# EAGLE design WdParent (EAGLE 8.5.1)
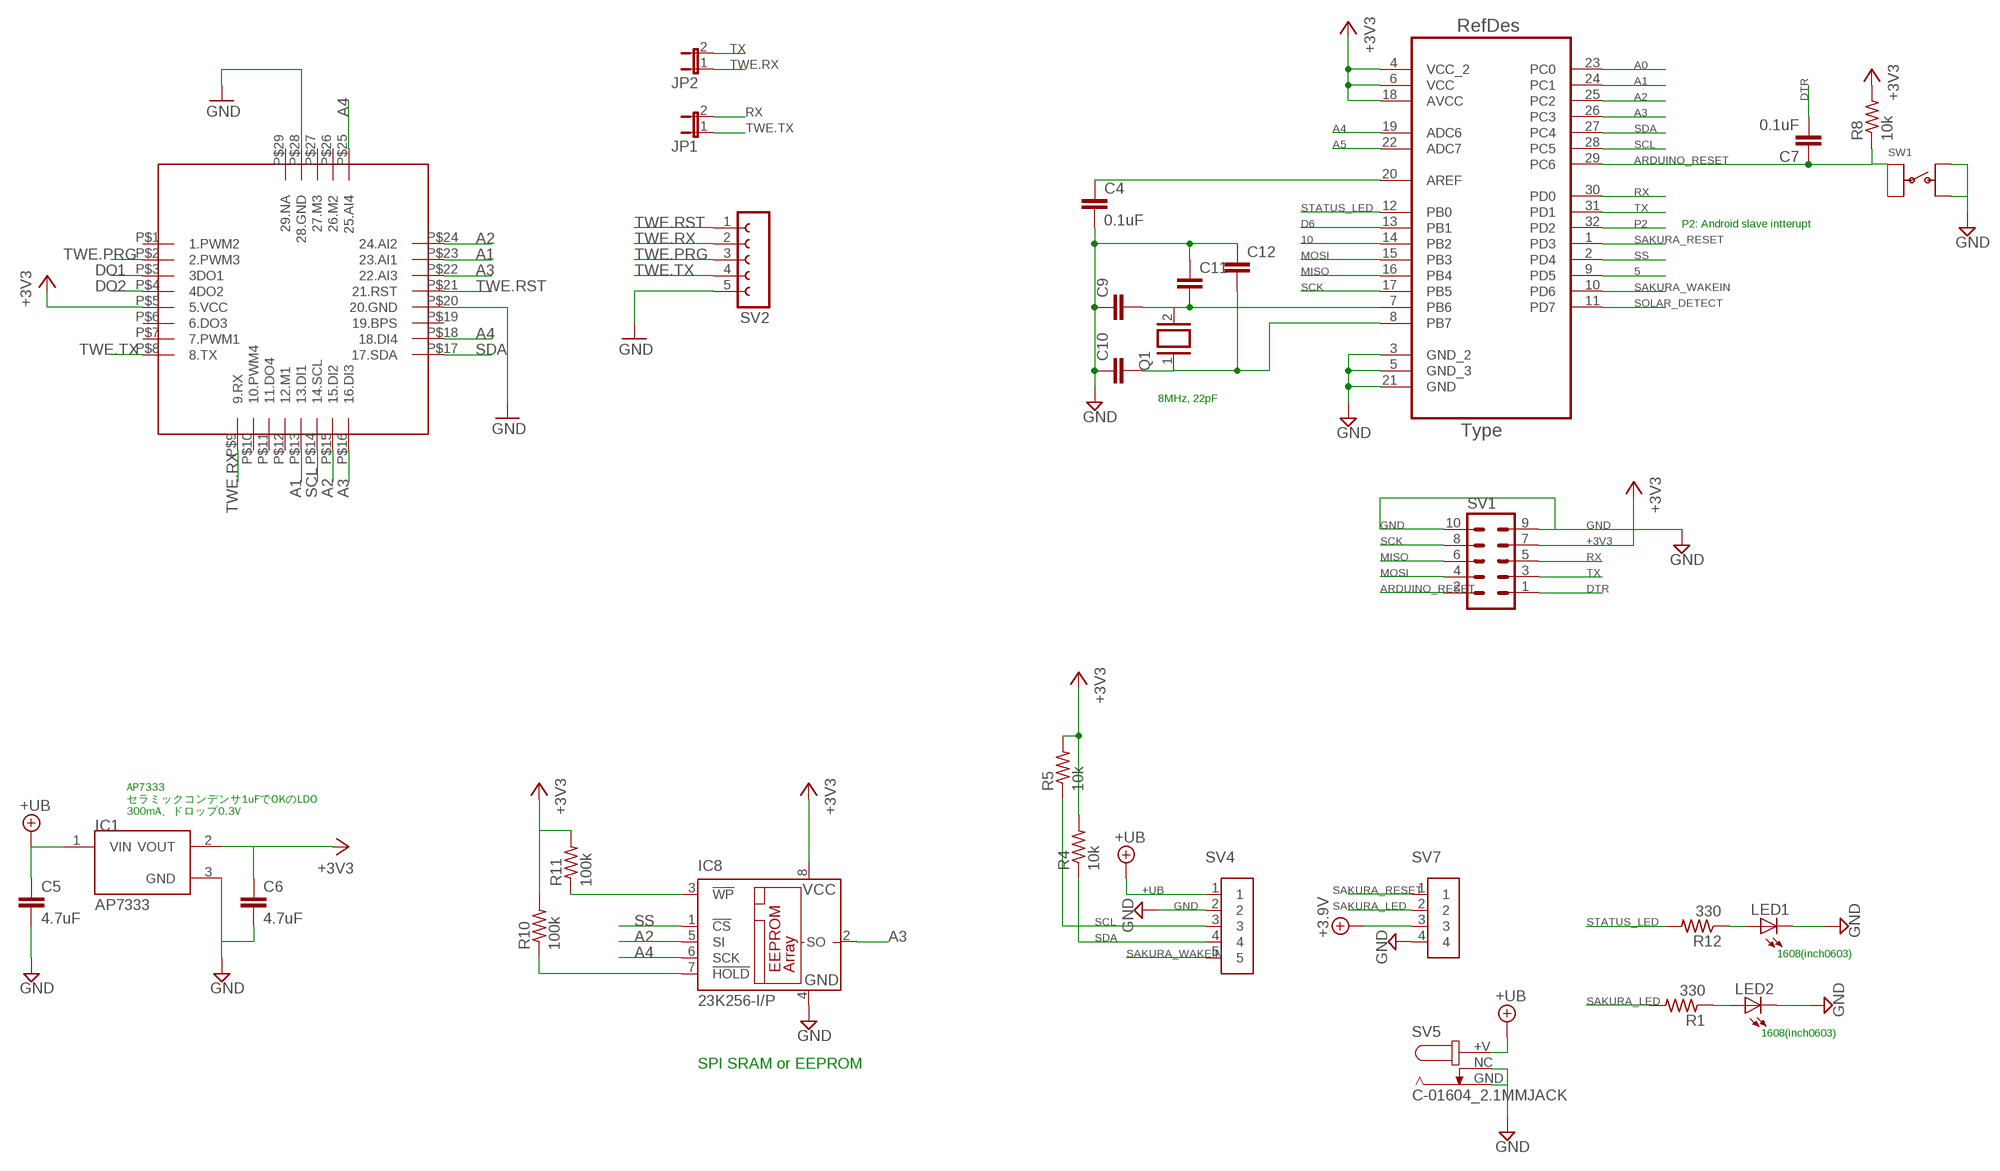
[diagram p0: schematic, sheet 1]

## Parts
C4  0.1uF  C-EUC0603  [C0603]
C5  4.7uF  C-EUC0603  [C0603]
C6  4.7uF  C-EUC0603  [C0603]
C7  0.1uF  C-EUC0603  [C0603]
C9  C-EU025-025X050  [C025-025X050]
C10  C-EU025-025X050  [C025-025X050]
C11  C-EUC0603  [C0603]
C12  C-EUC0603  [C0603]
IC1  AP7333  I-11360_AP7333_LDO3V3_REG  [SOT23]
IC8  23K256-I/P  25AA040P  [DIL8]
JP1  JP1E  [JP1]
JP2  JP1E  [JP1]
LED1  LEDCHIPLED_0603  [CHIPLED_0603]
LED2  LEDCHIPLED_0603  [CHIPLED_0603]
Q1  XTAL/S  [QS]
R1  330  R-US_R0603  [R0603]
R4  10k  R-US_R0603  [R0603]
R5  10k  R-US_R0603  [R0603]
R8  10k  R-US_R0603  [R0603]
R10  100k  R-US_R0603  [R0603]
R11  100k  R-US_R0603  [R0603]
R12  330  R-US_R0603  [R0603]
SV1  MA05-2  [MA05-2]
SV2  FE05-1  [FE05-1]
SV4  PINHEADER_5_2.54MM  [PINHEADER_5_2.54MM]
SV5  C-01604_2.1MMJACK  [2.1MMJACK_SLIM]
SV7  PINHEADER_4_2.54MM  [PINHEADER_4_2.54MM]
SW1  TACT_SWITCH  [TACT_SWITCH]
U1  ATMEGA328P-AU  [QFP80P900X900X120-32N]
U$1  LITE  [LITE]

## Nets
5: U1.9(PD5)
10: U1.14(PB2)
+3.9V [pow]: SV7.3
+3V3: C6.1 IC1.2(VOUT) IC8.8(VCC) R4.2 R5.2 R8.2 R10.2 R11.2 SV1.7 U1.4(VCC_2) U1.6(VCC) U1.18(AVCC) U$1.P$5(5.VCC)
+UB: C5.1 IC1.1(VIN) SV4.1 SV5.+V(VCC)
A0: U1.23(PC0)
A1: U1.24(PC1) U$1.P$13(13.DI1) U$1.P$23(23.AI1)
A2: IC8.5(SI) U1.25(PC2) U$1.P$15(15.DI2) U$1.P$24(24.AI2)
A3: IC8.2(SO) U1.26(PC3) U$1.P$16(16.DI3) U$1.P$22(22.AI3)
A4: IC8.6(SCK) U1.19(ADC6) U$1.P$18(18.DI4) U$1.P$25(25.AI4)
A5: U1.22(ADC7)
ARDUINO_RESET: C7.1 R8.1 SV1.2 SW1.1 SW1.2 U1.29(PC6)
D6: U1.13(PB1)
DO1: U$1.P$3(3DO1)
DO2: U$1.P$4(4DO2)
DTR: C7.2 SV1.1
GND: C4.2 C5.2 C6.2 C9.1 C10.1 C11.1 C12.1 IC1.3(GND) IC8.4(GND) LED1.C LED2.C SV1.9 SV1.10 SV2.5 SV4.2 SV5.GND SV5.NC(S) SV7.4 SW1.3 SW1.4 U1.3(GND_2) U1.5(GND_3) U1.21(GND) U$1.P$20(20.GND) U$1.P$28(28.GND)
MISO: SV1.6 U1.16(PB4)
MOSI: SV1.4 U1.15(PB3)
N$3: LED2.A R1.1
N$4: IC8.7(!HOLD) R10.1
N$6: IC8.3(!WP) R11.1
N$7: LED1.A R12.1
N$9: C9.2 C11.2 Q1.2 U1.7(PB6)
N$11: C10.2 C12.2 Q1.1 U1.8(PB7)
N$13: C4.1 U1.20(AREF)
P2: U1.32(PD2)
RX: JP1.2 SV1.5 U1.30(PD0)
SAKURA_LED: R1.2 SV7.2
SAKURA_RESET: SV7.1 U1.1(PD3)
SAKURA_WAKEIN: SV4.5 U1.10(PD6)
SCK: SV1.8 U1.17(PB5)
SCL: R5.1 SV4.3 U1.28(PC5) U$1.P$14(14.SCL)
SDA: R4.1 SV4.4 U1.27(PC4) U$1.P$17(17.SDA)
SOLAR_DETECT: U1.11(PD7)
SS: IC8.1(!CS) U1.2(PD4)
STATUS_LED: R12.2 U1.12(PB0)
TWE.PRG: SV2.3 U$1.P$2(2.PWM3)
TWE.RST: SV2.1 U$1.P$21(21.RST)
TWE.RX: JP2.1 SV2.2 U$1.P$9(9.RX)
TWE.TX: JP1.1 SV2.4 U$1.P$8(8.TX)
TX: JP2.2 SV1.3 U1.31(PD1)
Unconnected: U$1.P$1(1.PWM2) U$1.P$6(6.DO3) U$1.P$7(7.PWM1) U$1.P$10(10.PWM4) U$1.P$11(11.DO4) U$1.P$12(12.M1) U$1.P$19(19.BPS) U$1.P$26(26.M2) U$1.P$27(27.M3) U$1.P$29(29.NA)

## Notes on the sheet
- P2: Android slave intterupt
- 8MHz, 22pF
- AP7333
  セラミックコンデンサ1uFでOKのLDO
  300mA、ドロップ0.3V
- 1608(inch0603)
- 1608(inch0603)
- SPI SRAM or EEPROM

## Library data of the parts
C4-C7 C9-C12 = rcl:C-EU: CAPACITOR, European symbol
IC1 = Akizuki:I-11360_AP7333_LDO3V3_REG: 300mA drop:0.3v, 3v3 LDO http://akizukidenshi.com/catalog/g/gI-11360/
IC8 = microchip:25*: Serial EEPROM 4K/ 8K , SPI bus; MF: MICROCHIP; MPN: 25AA040-I/P; OC_FARNELL: 1331347; OC_NEWARK: 92C7334
JP1 JP2 = jumper:JP1E: JUMPER
LED1 LED2 = led:LED: LED OSRAM: - CHIPLED LG R971, LG N971, LY N971, LG Q971, LY Q971, LO R971, LY R971 LH N974, LH R974 LS Q976, LO Q976, LY Q976 LO Q996 - Hyper CHIPLED LW Q18S LB Q993, LB Q99A, LB R99A - SideLED LS A670, LO A670, LY A670, LG A670, LP A670 LB A673, LV A673, LT A673, LW A673 LH A674 LY A675 LS A676, LA A676, LO A676, LY A676, LW A676 LS A679, LY A679, LG A679 - Hyper Micro SIDELED® LS Y876, LA Y876, LO Y876, LY Y876 LT Y87S - SmartLED LW L88C, LW L88S LB L89C, LB L89S, LG L890 LS L89K, LO L89K, LY L89K LS L896, LA L896, LO L896, LY L896 - TOPLED LS T670, LO T670, LY T670, LG T670, LP T670 LSG T670, LSP T670, LSY T670, LOP T670, LYG T670 LG T671, LOG T671, LSG T671 LB T673, LV T673, LT T673, LW T673 LH T674 LS T676, LA T676, LO T676, LY T676, LB T676, LH T676, LSB T676, LW T676 LB T67C, LV T67C, LT T67C, LS T67K, LO T67K, LY T67K, LW E67C LS E67B, LA E67B, LO E67B, LY E67B, LB E67C, LV E67C, LT E67C LW T67C LS T679, LY T679, LG T679 LS T770, LO T770, LY T770, LG T770, LP T770 LB T773, LV T773, LT T773, LW T773 LH T774 LS E675, LA E675, LY E675, LS T675 LS T776, LA T776, LO T776, LY T776, LB T776 LHGB T686 LT T68C, LB T68C - Hyper Mini TOPLED® LB M676 - Mini TOPLED Santana® LG M470 LS M47K, LO M47K, LY M47K Source: http://www.osram.convergy.de LUXEON: - LUMILED® LXK2-PW12-R00, LXK2-PW12-S00, LXK2-PW14-U00, LXK2-PW14-V00 LXK2-PM12-R00, LXK2-PM12-S00, LXK2-PM14-U00 LXK2-PE12-Q00, LXK2-PE12-R00, LXK2-PE12-S00, LXK2-PE14-T00, LXK2-PE14-U00 LXK2-PB12-K00, LXK2-PB12-L00, LXK2-PB12-M00, LXK2-PB14-N00, LXK2-PB14-P00, LXK2-PB14-Q00 LXK2-PR12-L00, LXK2-PR12-M00, LXK2-PR14-Q00, LXK2-PR14-R00 LXK2-PD12-Q00, LXK2-PD12-R00, LXK2-PD12-S00 LXK2-PH12-R00, LXK2-PH12-S00 LXK2-PL12-P00, LXK2-PL12-Q00, LXK2-PL12-R00 Source: www.luxeon.com KINGBRIGHT: KA-3528ASYC Source: www.kingbright.com
Q1 = special:XTAL/S: CRYSTAL
R1 R4 R5 R8 R10-R12 = resistor:R-US_: RESISTOR, American symbol
SV1 = con-lstb:MA05-2: PIN HEADER; OC_FARNELL: unknown; OC_NEWARK: unknown
SV2 = con-lsta:FE05-1: FEMALE HEADER; OC_FARNELL: unknown; OC_NEWARK: unknown
SV4 = Akizuki:PINHEADER_5_2.54MM
SV5 = Akizuki:C-01604_2.1MMJACK
SV7 = Akizuki:PINHEADER_4_2.54MM
SW1 = Akizuki:TACT_SWITCH: タクトスイッチ汎用 http://akizukidenshi.com/catalog/g/gP-09825/ http://akizukidenshi.com/catalog/g/gP-09824/
U1 = ATMega328pAU:ATMEGA328P-AU; DESCRIPTION: 8-bit Microcontroller with In-System Programmable Flash; MPN: ATMEGA328P-AU; OC_FARNELL: 1715486; OC_NEWARK: 14R4631; PACKAGE: TQFP-32; SUPPLIER: Atmel
U$1 = TWELite:LITE

## Board
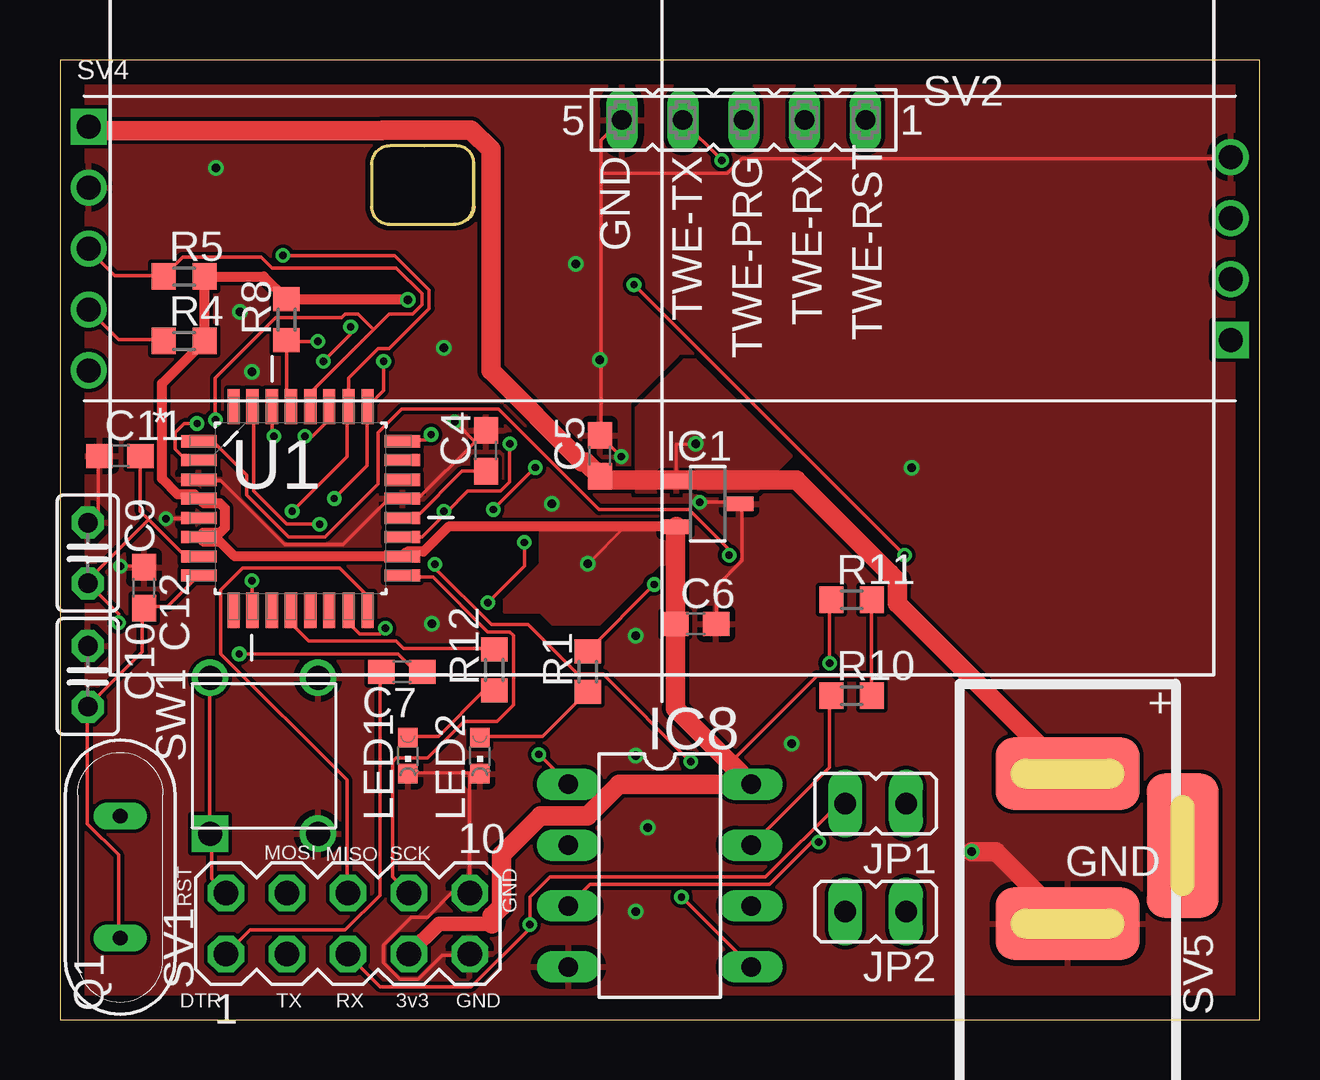
[diagram p1: board, top side]
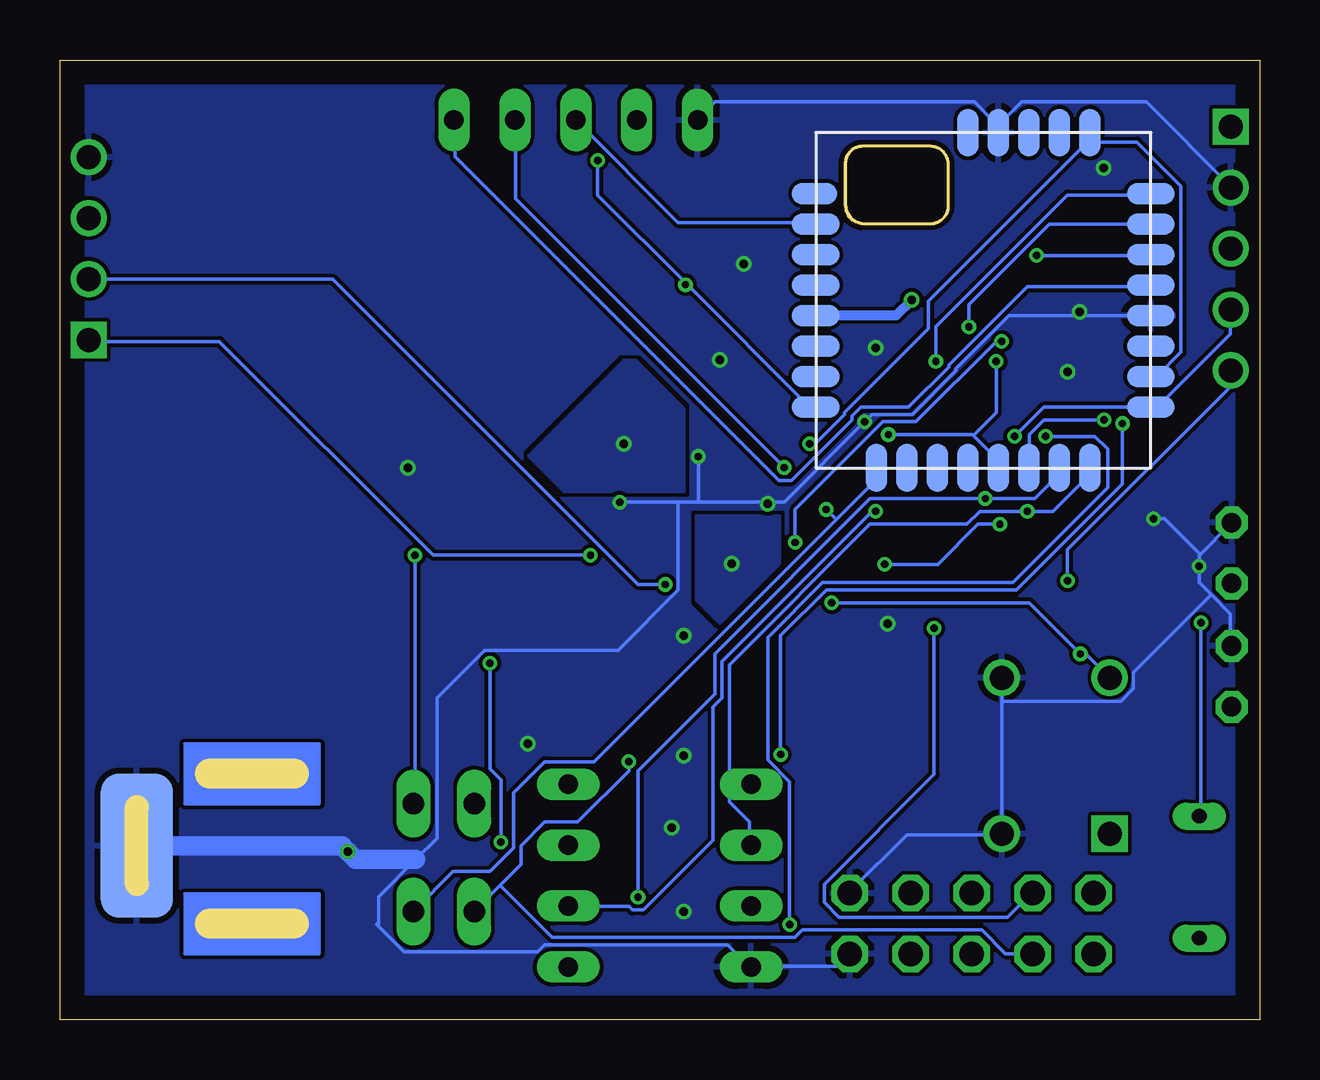
[diagram p2: board, bottom side, seen from below]

Size 50 x 40 mm. Coordinates in mm from the lower left corner, seen from the top.
Outline: 0,0 50,0 50,40 0,40 0,0
Copper layers (1*16): Top 0.035mm / dielectric 1.5mm / Bottom 0.035mm
Design rules "SeeedStudio_2layer_DRU_no_angle_20140221": minimum track width 6mil, minimum drill 12mil, track to track 6mil, track to pad 6mil, pad to pad 6mil, via to via 6mil, smd to smd 0mil, copper to edge 10mil, drill to drill 10mil, minimum pad ring 10mil, minimum via ring 6mil, stop-mask expansion 2mil, vias tented up to drill 100mil, thermal gap 10mil
tRestrict: area 0,0 to 50,1; area 49,1 to 50,40; area 0,1 to 1,40; area 0,39 to 50,40
bRestrict: area 49,0 to 50,40; area 0,0 to 49,1; area 0,39 to 49,40; area 0,1 to 1,40

### Footprints (pad centres in the part's own frame; a part is rotated, then mirrored left to right if it is on the bottom)
C0603 = smd 1.1 x 1: 1 -0.85,0; 2 0.85,0
C025-025X050 = drill 0.813 octagon: 1 -1.27,0; 2 1.27,0
SOT23 = smd 0.6 x 1.2: 1 -0.95,-1.306; 2 0.95,-1.306; 3 0,1.306
DIL8 = drill 0.813 long: 1 -3.81,-3.81; 2 -1.27,-3.81; 3 1.27,-3.81; 4 3.81,-3.81; 5 3.81,3.81; 6 1.27,3.81; 7 -1.27,3.81; 8 -3.81,3.81
JP1 = drill 0.914 long: 1 0,-1.27; 2 0,1.27
CHIPLED_0603 = smd 0.8 x 0.8: A 0,-0.75; C 0,0.75
QS = drill 0.61 long: 1 -2.54,0; 2 2.54,0
R0603 = smd 1 x 1.1: 1 -0.85,0; 2 0.85,0
MA05-2 = drill 1.016 octagon: 1 -5.08,-1.27; 2 -5.08,1.27; 3 -2.54,-1.27; 4 -2.54,1.27; 5 0,-1.27; 6 0,1.27; 7 2.54,-1.27; 8 2.54,1.27; 9 5.08,-1.27; 10 5.08,1.27
FE05-1 = drill 0.813 long: 1 -5.08,0; 2 -2.54,0; 3 0,0; 4 2.54,0; 5 5.08,0
PINHEADER_5_2.54MM = drill 1 square: 1 -5.08,0 | drill 1: 2 -2.54,0; 3 0,0; 4 2.54,0; 5 5.08,0
2.1MMJACK_SLIM = smd 6 x 3: +V 0,6.25; GND 0,0 | smd 3 x 6: @2 4.8,3.25 | smd 3 x 6 bottom: NC 4.8,3.25
PINHEADER_4_2.54MM = drill 1 square: 1 -3.81,0 | drill 1: 2 -1.27,0; 3 1.27,0; 4 3.81,0
TACT_SWITCH = drill 1 square: 1 -3.25,2.25 | drill 1: 2 3.25,2.25; 3 -3.25,-2.25; 4 3.25,-2.25
QFP80P900X900X120-32N = smd 1.473 x 0.508: 1 -4.242,2.794; 2 -4.242,2.007; 3 -4.242,1.194; 4 -4.242,0.406; 5 -4.242,-0.406; 6 -4.242,-1.194; 7 -4.242,-2.007; 8 -4.242,-2.794; 17 4.242,-2.794; 18 4.242,-2.007; 19 4.242,-1.194; 20 4.242,-0.406; 21 4.242,0.406; 22 4.242,1.194; 23 4.242,2.007; 24 4.242,2.794 | smd 0.508 x 1.473: 9 -2.794,-4.242; 10 -2.007,-4.242; 11 -1.194,-4.242; 12 -0.406,-4.242; 13 0.406,-4.242; 14 1.194,-4.242; 15 2.007,-4.242; 16 2.794,-4.242; 25 2.794,4.242; 26 2.007,4.242; 27 1.194,4.242; 28 0.406,4.242; 29 -0.406,4.242; 30 -1.194,4.242; 31 -2.007,4.242; 32 -2.794,4.242
LITE = smd 1.9 x 0.9: P$1 -0.05,11.43 | smd 2 x 0.9: P$2 0,10.16; P$3 0,8.89; P$4 0,7.62; P$5 0,6.35; P$6 0,5.08; P$7 0,3.81; P$8 0,2.54; P$17 13.97,2.54; P$18 13.97,3.81; P$19 13.97,5.08; P$20 13.97,6.35; P$21 13.97,7.62; P$22 13.97,8.89; P$23 13.97,10.16; P$24 13.97,11.43 | smd 0.9 x 2: P$9 2.54,0; P$10 3.81,0; P$11 5.08,0; P$12 6.35,0; P$13 7.62,0; P$14 8.89,0; P$15 10.16,0; P$16 11.43,0; P$25 11.43,13.97; P$26 10.16,13.97; P$27 8.89,13.97; P$28 7.62,13.97; P$29 6.35,13.97

### Placement (x,y rotation side)
C4  17.75,23.71 90 top
C5  22.5,23.5 90 top
C6  26.5,16.5 0 top
C7  14.25,14.5 180 top
C9  1.16,19.45 270 top
C10  1.16,14.3 270 top
C11  2.5,23.5 0 top
C12  3.5,18 270 top
IC1  27,21.5 270 top
IC8  25,6 270 top
JP1  34,9 90 top
JP2  34,4.5 90 top
LED1  14.5,11 180 top
LED2  17.5,11 180 top
Q1  2.51,5.93 90 top
R1  22,14.5 90 top
R4  5.18,28.29 0 top
R5  5.18,30.98 0 top
R8  9.44,29.18 90 top
R10  33,13.5 0 top
R11  33,17.5 0 top
R12  18.11,14.57 90 top
SV1  12,4 0 top
SV2  28.5,37.5 180 top
SV4  1.2,32.14 270 top
SV5  42,4 0 top
SV7  48.8,32.14 90 top
SW1  8.5,11 90 top
U1  10.03,21.31 0 top
U$1  18.5,23 0 bottom

### Tracks (layer width: path | path; a pad name or v marks a point on that pad's centre or on a via)
+3V3  (via drill 0.35)
  Top 0.127: v22,19 23.55,20.55 IC1.2
  Top 0.152: 33.83,14.33 33.83,17.45 R11.2 | 33.83,14.33 33.83,13.56 R10.2 | 33.83,14.33 31.55,14.33 27.92,10.7
  Top 0.406: IC1.2 16.2,20.55 15.16,19.51 14.47,19.51 U1.18 7.28,19.3 6.67,19.91 5.99,19.91 U1.6 5.97,20.29 6.67,20.29 6.88,20.5 6.88,21.3 6.67,21.51 5.99,21.51 U1.4 5.61,21.89 4.9,21.89 4.26,22.54 4.26,26.51 R4.2 R5.2 8.5,30.98 R8.2 14.47,30.03 v14.5,30
  Top 0.61: 18,4 15.81,4 SV1.7
  Top 0.813: IC1.2 25.65,20.51 C6.1 25.65,12.97 27.92,10.7 IC8.8 23.3,9.81 21.98,8.49 20.02,8.49 18.4,6.87 18.4,4.72 18,4.32 18,4
  Bottom 0.406: v14.5,30 15.15,29.35 U$1.P$5
  pour Top: 25.5,20.5 20,20.5 20,19 18.5,17.5 18.5,17 20,17 20.5,16.5 22.5,16.5 25,19 25.5,19
  pour Bottom: 20,21 23.5,21 23.5,18 23.5,17.5 22.5,16.5 20,19
+UB  (via drill 0.35)
  Top 0.127: IC1.1 25.69,24 v26.5,24
  Top 0.152: IC1.1 25.76,22.48 25.76,22.5
  Top 0.813: SV4.1 1.37,37.05 13.4,37.05 13.41,37.05 13.45,37.08 17.14,37.08 17.96,36.26 17.96,27.05 21.77,23.24 21.91,23.24 C5.1 22.65,22.5 25.76,22.5 30.69,22.5 34.59,18.59 34.91,18.28 34.91,18.09 34.91,17.34 SV5.+V
  pour Bottom: 29,22 30.5,23.5 26.5,27.5 26,27.5 24,25.5 24,22
  pour Top: 24,22 29,22 30.5,23.5 26.5,27.5 26,27.5 24,25.5
A1  (via drill 0.3)
  Top 0.152: v15.47,24.38 15.24,24.16 14.33,24.16 U1.24 | v12.12,28.88 12.12,28.57 v10.97,27.43
  Bottom 0.152: v15.47,24.38 11.96,24.38 11.93,24.35 | 11.93,24.35 10.9,23.32 10.9,23.01 U$1.P$13 | v12.12,28.88 12.12,29.79 8.76,33.15 4.57,33.15 U$1.P$23 | v10.97,27.43 10.97,25.3 11.93,24.35
A2  (via drill 0.3)
  Top 0.152: v11.43,21.72 12.8,23.09 12.8,25.53 U1.25 12.88,25.6 13.49,26.21 v13.49,27.43 | v25.91,5.11 28.8,2.21 IC8.5
  Bottom 0.152: U$1.P$15 8.38,22.94 8.38,22.71 9.37,21.72 v11.43,21.72 16.23,21.72 22.71,15.24 22.71,13.56 25.91,10.36 v25.91,5.11 | v13.49,27.43 13.49,28.88 8,34.37 4.57,34.37 U$1.P$24
A3  (via drill 0.3)
  Top 0.152: v9.68,21.18 11.96,23.47 11.96,25.53 U1.26 12.04,25.6 12.04,26.75 13.26,27.96 13.72,27.96 15.39,29.64 15.39,30.4 13.95,31.85 v9.3,31.85
  Bottom 0.152: U$1.P$16 7.09,22.94 7.09,22.71 8.61,21.18 v9.68,21.18 11.66,21.18 12.19,20.65 16.23,20.65 22.1,14.78 22.1,9.07 21.26,8.23 21.26,7.32 IC8.2 | v9.3,31.85 4.57,31.85 U$1.P$22
A4  (via drill 0.3)
  Top 0.152: 16.12,21.14 16.99,22.02 18.36,22.02 18.75,22.4 v18.75,24 | 16.12,21.14 15.09,20.12 14.33,20.12 U1.19 | v16,21.18 16.08,21.18 16.12,21.14
  Bottom 0.152: v18.75,24 18.52,24 17.3,25.22 17.3,25.3 13.79,28.8 13.79,29.95 7.09,36.65 7.09,36.96 U$1.P$25 7.09,36.58 5.11,36.58 3.28,34.75 3.28,27.81 4.27,26.82 4.5,26.82 U$1.P$18 | v16,21.18 16.15,21.18 22.4,14.94 22.4,13.41 22.78,13.03 22.78,7.47 25.68,4.57 26.14,4.57 26.29,4.72 IC8.6
ARDUINO_RESET  (via drill 0.3)
  Top 0.152: SV1.2 6.86,5.33 6.33,5.87 6.33,7.7 SW1.1 6.25,7.77 SW1.2 | U1.29 9.6,25.6 9.45,25.76 9.45,28.27 R8.1 9.53,28.27 v10.74,28.27 | v7.47,15.24 14.1,15.24 14.78,14.55 15.09,14.55 C7.1 | v19.36,19.89 19.36,18.9 v17.83,17.37
  Bottom 0.152: SW1.2 6.33,14.33 7.24,15.24 v7.47,15.24 9.6,17.37 v17.83,17.37 | v10.74,28.27 10.97,28.27 14.33,24.92 15.7,24.92 19.36,21.26 v19.36,19.89
DTR
  Top 0.152: C7.2 13.34,14.48 13.34,5.18 11.89,3.73 7.92,3.73 6.93,2.74 SV1.1
GND  (via drill 0.3, 0.35)
  Top 0.152: C6.2 27.36,16.54 27.36,18.06 28.42,19.13 28.42,21.41 28.35,21.49 IC1.3 28.27,21.57 v26.67,21.57 | 17.3,24.08 14.94,21.72 14.33,21.72 U1.21 14.25,21.64 13.64,21.64 11.81,19.81 9.37,19.81 6.71,22.48 5.79,22.48 U1.3 | 17.3,24.08 17.75,24.54 C4.2 17.3,24.08 | 17.3,24.08 v16.46,24.92 | 22.55,35.28 22.55,36.65 23.39,37.49 SV2.5 | 22.55,35.28 22.55,24.38 C5.2 22.55,24.31 v23.39,23.47 | 22.55,35.28 27.81,35.28 28.42,35.89 48.77,35.89 SV7.4 | C11.1 1.6,23.47 1.6,21.11 1.22,20.73 C9.1 | v2.52,18.9 3.43,18.9 C12.1 | v4.42,20.88 5.71,20.88 U1.5 | 17.07,10.29 17.45,10.29 LED2.C | 17.07,10.29 14.55,10.29 LED1.C | 17.07,10.29 17.07,5.33 SV1.10 16.99,5.33 16.38,5.33 15.32,4.27 14.63,4.27 13.49,3.12 13.49,2.36 14.17,1.68 14.94,1.68 15.93,2.67 17.07,2.67 SV1.9
  Top 0.813: SV5.GND 39,7 v38,7
  Bottom 0.152: U$1.P$20 4.57,29.34 10.44,29.34 12.65,27.13 12.65,27.05 14.48,25.22 16.15,25.22 v16.46,24.92 19.81,21.57 23.39,21.57 | 23.39,21.57 24.23,21.57 | 24.23,21.57 v26.67,21.57 | SV4.2 1.22,34.75 4.72,38.25 9.91,38.25 10.82,37.34 10.82,37.03 U$1.P$28 10.82,37.41 11.05,37.41 11.89,38.25 22.71,38.25 23.39,37.57 SV2.5 | v23.39,23.47 23.39,21.57 | 2.48,19.39 1.22,20.65 C9.1 | 2.48,19.39 2.52,19.36 v2.52,18.9 2.52,18.21 2.02,17.72 | v4.42,20.88 3.96,20.88 2.48,19.39 | 2.02,17.72 1.22,16.92 1.22,15.62 C10.1 | 10.74,13.26 SW1.4 | 10.74,13.26 10.74,7.77 SW1.3 10.82,7.7 14.71,7.7 17.07,5.33 SV1.10 | SV1.9 17.14,2.67 17.6,2.21 21.18,2.21 IC8.4 21.26,2.21 22.17,3.12 29.79,3.12 30.1,2.82 35.66,2.82 36.77,3.92 | 2.02,17.72 5.26,14.48 5.26,13.79 5.79,13.26 10.74,13.26 | 36.77,3.92 36.8,3.96 | 24.23,21.57 24.23,17.91 26.75,15.39 32.31,15.39 34.29,13.41 34.29,7.54 35.17,6.67 36.73,5.11 36.73,3.96 36.77,3.92
  Bottom 0.813: 35.17,6.67 37.67,6.67 v38,7 38.25,7.25 SV5.NC
  other vias: 35.5,23 21.5,31.5 22.5,27.5 24,16 30.5,11.5 24.5,8 24,11 24,4.5 15.5,16.5 16,28 7.5,29.5 8,27 6.5,35.5 20.5,21.5
  pour Bottom (rank 6): 1,39 49,39 49,1 1,1
  pour Top (rank 6): 1,39 49,39 49,1 1,1
MISO
  Top 0.152: U1.16 12.8,17.07 12.8,17.68 11.66,18.82 7.62,18.82 6.71,17.91 6.71,15.24 11.96,9.98 11.96,5.33 SV1.6
MOSI  (via drill 0.3)
  Top 0.152: v13.56,16.31 13.34,16.08 12.5,16.08 12.04,16.54 12.04,16.99 U1.15
  Bottom 0.152: v13.56,16.31 13.56,10.21 18.14,5.64 18.14,4.88 17.53,4.27 10.52,4.27 9.53,5.26 SV1.4
N$3
  Top 0.152: LED2.A 17.53,11.81 20.12,11.81 21.95,13.64 R1.1
N$4
  Top 0.152: R10.1 32.08,13.49 32.08,10.52 28.88,7.32 IC8.7
N$6  (via drill 0.3)
  Top 0.152: v32.08,14.86 32.08,17.45 R11.1 | v31.62,7.39 31.32,7.39 29.57,5.64 22.1,5.64 21.26,4.8 IC8.3
  Bottom 0.152: v32.08,14.86 32.08,10.44 31.62,9.98 v31.62,7.39
N$7
  Top 0.152: LED1.A 14.55,11.81 15.77,11.81 17.68,13.72 18.06,13.72 R12.1
N$9  (via drill 0.3)
  Top 0.152: 3.7,20.84 5.18,19.36 5.71,19.36 U1.7 | 3.7,20.84 3.35,21.18 3.35,23.47 C11.2 | v2.44,16.54 2.44,16.92 1.22,18.14 C9.2 1.22,18.21 1.22,18.36 3.7,20.84
  Bottom 0.152: v2.44,16.54 2.44,8.53 Q1.2
N$11
  Top 0.152: U1.8 5.71,18.44 4.5,17.22 3.5,17.22 C12.2 3.43,17.14 3.43,15.32 1.22,13.11 C10.2 1.14,13.03 1.14,8.15 2.44,6.86 2.44,3.43 Q1.1
N$13
  Top 0.152: C4.1 16.76,22.86 14.86,20.95 14.33,20.95 U1.20
RX  (via drill 0.3)
  Top 0.152: v8.91,24.31 8.84,24.38 8.84,25.53 U1.30 | SV1.5 12.04,2.67 13.34,1.37 17.14,1.37 19.58,3.81 v19.58,3.96 19.58,5.11 20.42,5.94 29.41,5.94 32.46,8.99 32.69,8.99 JP1.2
  Bottom 0.152: v8.91,24.31 6.86,24.31 6.33,23.77 6.33,22.17 10.29,18.21 18.21,18.21 20.5,15.93 20.5,10.82 19.58,9.91 v19.58,3.96
SAKURA_LED  (via drill 0.3)
  Top 0.152: v24.77,18.14 22.02,15.39 R1.2
  Bottom 0.152: v24.77,18.14 25.91,18.14 38.63,30.86 48.77,30.86 SV7.2
SAKURA_RESET  (via drill 0.3)
  Top 0.152: v27.89,19.36 27.89,19.58 26.21,21.26 22.48,21.26 18.29,25.45 14.25,25.45 13.26,24.46 13.26,22.33 11.05,20.12 9.53,20.12 7.77,21.87 7.77,22.71 6.4,24.08 5.79,24.08 U1.1
  Bottom 0.152: v27.89,19.36 34.44,19.36 43.36,28.27 48.77,28.27 SV7.1
SAKURA_WAKEIN  (via drill 0.3)
  Top 0.152: v8,18.29 8,17.07 U1.10
  Bottom 0.152: v8,18.29 8,19.58 1.22,26.36 1.22,27.05 SV4.5
SCK
  Top 0.152: U1.17 14.33,18.44 15.54,18.44 17.83,16.15 18.75,16.15 18.9,16 18.9,13.11 18.21,12.42 16.84,12.42 15.32,10.9 14.02,10.9 13.87,10.74 13.87,5.94 14.48,5.33 SV1.8
SCL  (via drill 0.3)
  Top 0.152: SV4.3 1.22,32.08 2.29,31.01 4.27,31.01 R5.1 4.34,31.01 5.11,31.77 8.38,31.77 8.84,31.32 14.02,31.32 15.09,30.25 15.09,29.79 14.71,29.41 13.72,29.41 13.07,28.77 | 13.07,28.77 10.44,26.14 10.44,25.6 U1.28 | v6.48,24.99 6.48,26.75 8.99,29.26 11.73,29.26 11.89,29.41 12.42,29.41 13.07,28.77
  Bottom 0.152: v6.48,24.99 8.99,24.99 9.6,24.38 9.6,23.01 U$1.P$14
SDA  (via drill 0.3)
  Top 0.152: R4.1 4.27,28.35 2.44,28.35 1.22,29.57 SV4.4 | v10.21,24.31 10.52,24.31 11.2,24.99 11.2,25.53 U1.27
  Bottom 0.152: v10.21,24.31 8.99,25.53 4.57,25.53 U$1.P$17 4.5,25.6 4.19,25.6 1.22,28.57 1.22,29.57 SV4.4
SS  (via drill 0.3)
  Top 0.152: v5.71,24.84 5.18,24.84 4.8,24.46 4.8,23.77 5.26,23.32 5.71,23.32 U1.2 | v19.96,11.05 21.18,9.83 IC8.1
  Bottom 0.152: v5.71,24.84 5.71,22.33 10.13,17.91 18.06,17.91 19.96,16 v19.96,11.05
STATUS_LED
  Top 0.152: R12.2 18.06,15.47 14.33,15.47 14.02,15.77 10.36,15.77 9.68,16.46 9.68,16.99 U1.12
TWE.PRG
  Bottom 0.152: U$1.P$2 18.52,33.22 24.23,33.22 SV2.3
TWE.RST
  Bottom 0.152: U$1.P$21 4.57,30.56 9.68,30.56 12.95,27.28 12.95,27.2 14.63,25.53 16.61,25.53 16.99,25.15 16.99,24.99 19.51,22.48 20.04,22.48 33.53,35.97 33.53,37.49 SV2.1
TWE.RX  (via drill 0.3)
  Top 0.152: v18.06,21.26 v19.81,23.01
  Bottom 0.152: 17.64,20.84 27.74,10.74 29.79,10.74 31.09,9.45 31.09,7.16 32.08,6.17 33.6,6.17 35.2,4.57 JP2.1 | 17.64,20.84 16,22.48 16,22.94 U$1.P$9 | v19.81,23.01 31.01,34.21 31.01,37.49 SV2.2 | 17.64,20.84 v18.06,21.26
TWE.TX  (via drill 0.3)
  Top 0.152: v27.58,35.81 25.91,37.49 SV2.4 | v23.93,30.63 v35.2,19.36
  Bottom 0.152: 23.89,30.67 27.58,34.37 v27.58,35.81 | 23.89,30.67 18.82,25.6 18.52,25.6 U$1.P$8 | v35.2,19.36 35.2,9.07 JP1.1 | v23.93,30.63 23.89,30.67
TX  (via drill 0.3)
  Top 0.152: v10.82,20.65 9.45,20.65 8.08,22.02 8.08,25.53 U1.31 | v15.62,18.97 15.62,18.82 17.98,16.46 19.51,16.46 21.57,14.4 22.63,14.4 v26.29,10.74
  Bottom 0.152: v10.82,20.65 11.73,20.65 13.41,18.97 v15.62,18.97 | v26.29,10.74 26.29,10.36 28.42,8.23 29.79,8.23 30.79,7.24 30.79,6.48 31.66,5.6 | 31.66,5.6 32.69,4.57 JP2.2 | 31.66,5.6 29.49,3.43 19.36,3.43 19.05,3.73 11.58,3.73 10.59,2.74 9.53,2.74 SV1.3

### Text on the board
tPlace: GND | TWE-TX | TWE-PRG | TWE-RX | TWE-RST | + | MOSI | MISO | SCK | GND | RST | GND | DTR | TX | RX | 3v3 | GND